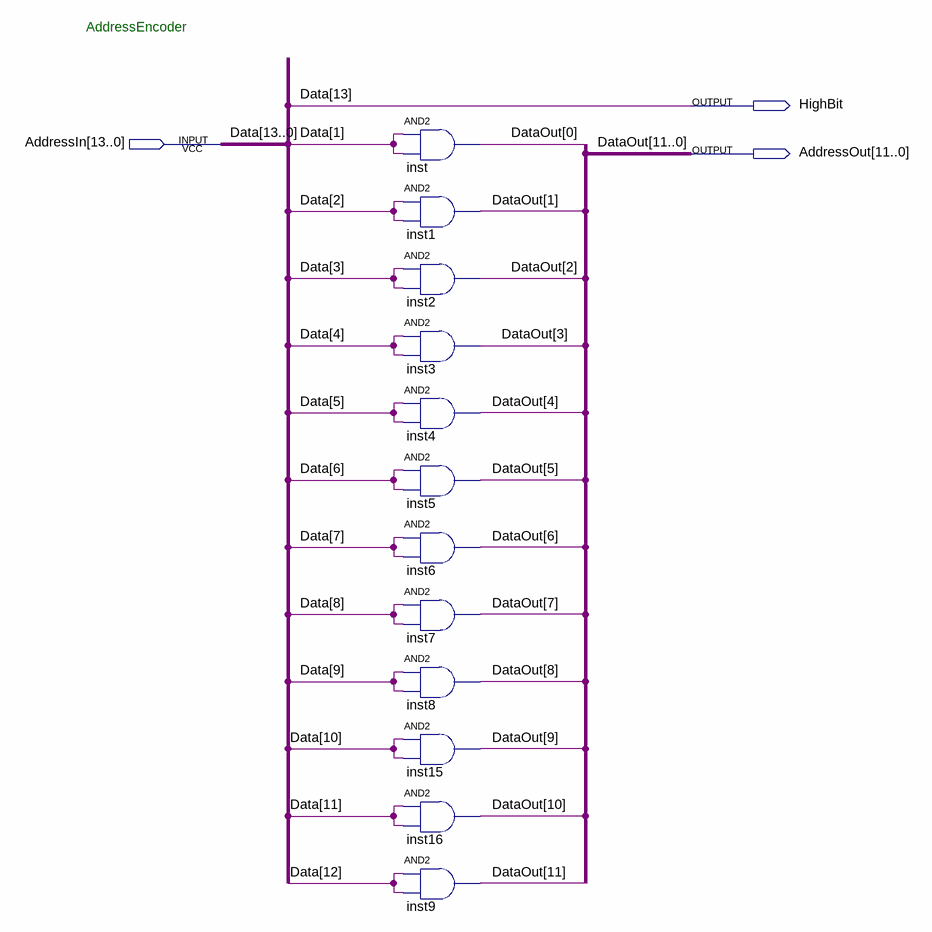
[diagram p0: schematic sheet]
// Quartus schematic AddressEncoder.bdf as structural Verilog: 12 symbols, 3 pins
module AddressEncoder (
  input  [13:0] AddressIn,
  output HighBit,
  output [11:0] AddressOut
);

  and inst (AddressOut[0], AddressIn[1], AddressIn[1]);
  and inst1 (AddressOut[1], AddressIn[2], AddressIn[2]);
  and inst2 (AddressOut[2], AddressIn[3], AddressIn[3]);
  and inst3 (AddressOut[3], AddressIn[4], AddressIn[4]);
  and inst4 (AddressOut[4], AddressIn[5], AddressIn[5]);
  and inst5 (AddressOut[5], AddressIn[6], AddressIn[6]);
  and inst6 (AddressOut[6], AddressIn[7], AddressIn[7]);
  and inst7 (AddressOut[7], AddressIn[8], AddressIn[8]);
  and inst8 (AddressOut[8], AddressIn[9], AddressIn[9]);
  and inst15 (AddressOut[9], AddressIn[10], AddressIn[10]);
  and inst16 (AddressOut[10], AddressIn[11], AddressIn[11]);
  and inst9 (AddressOut[11], AddressIn[12], AddressIn[12]);

  assign HighBit = AddressIn[13];

  // Other names for the same wires on the sheet: Data[13:0] = AddressIn; DataOut[11:0] = AddressOut

  // Notes on the sheet:
  //   AddressEncoder
endmodule
